# Altium schematic sheet Fri3D_2020_00.SchDoc: Top Level
size A3; Date: 11/07/2018; DrawnBy: Wim Van Gool; DocumentNumber: 1; Revision: 00; SheetNumber: 1; SheetTotal: 5
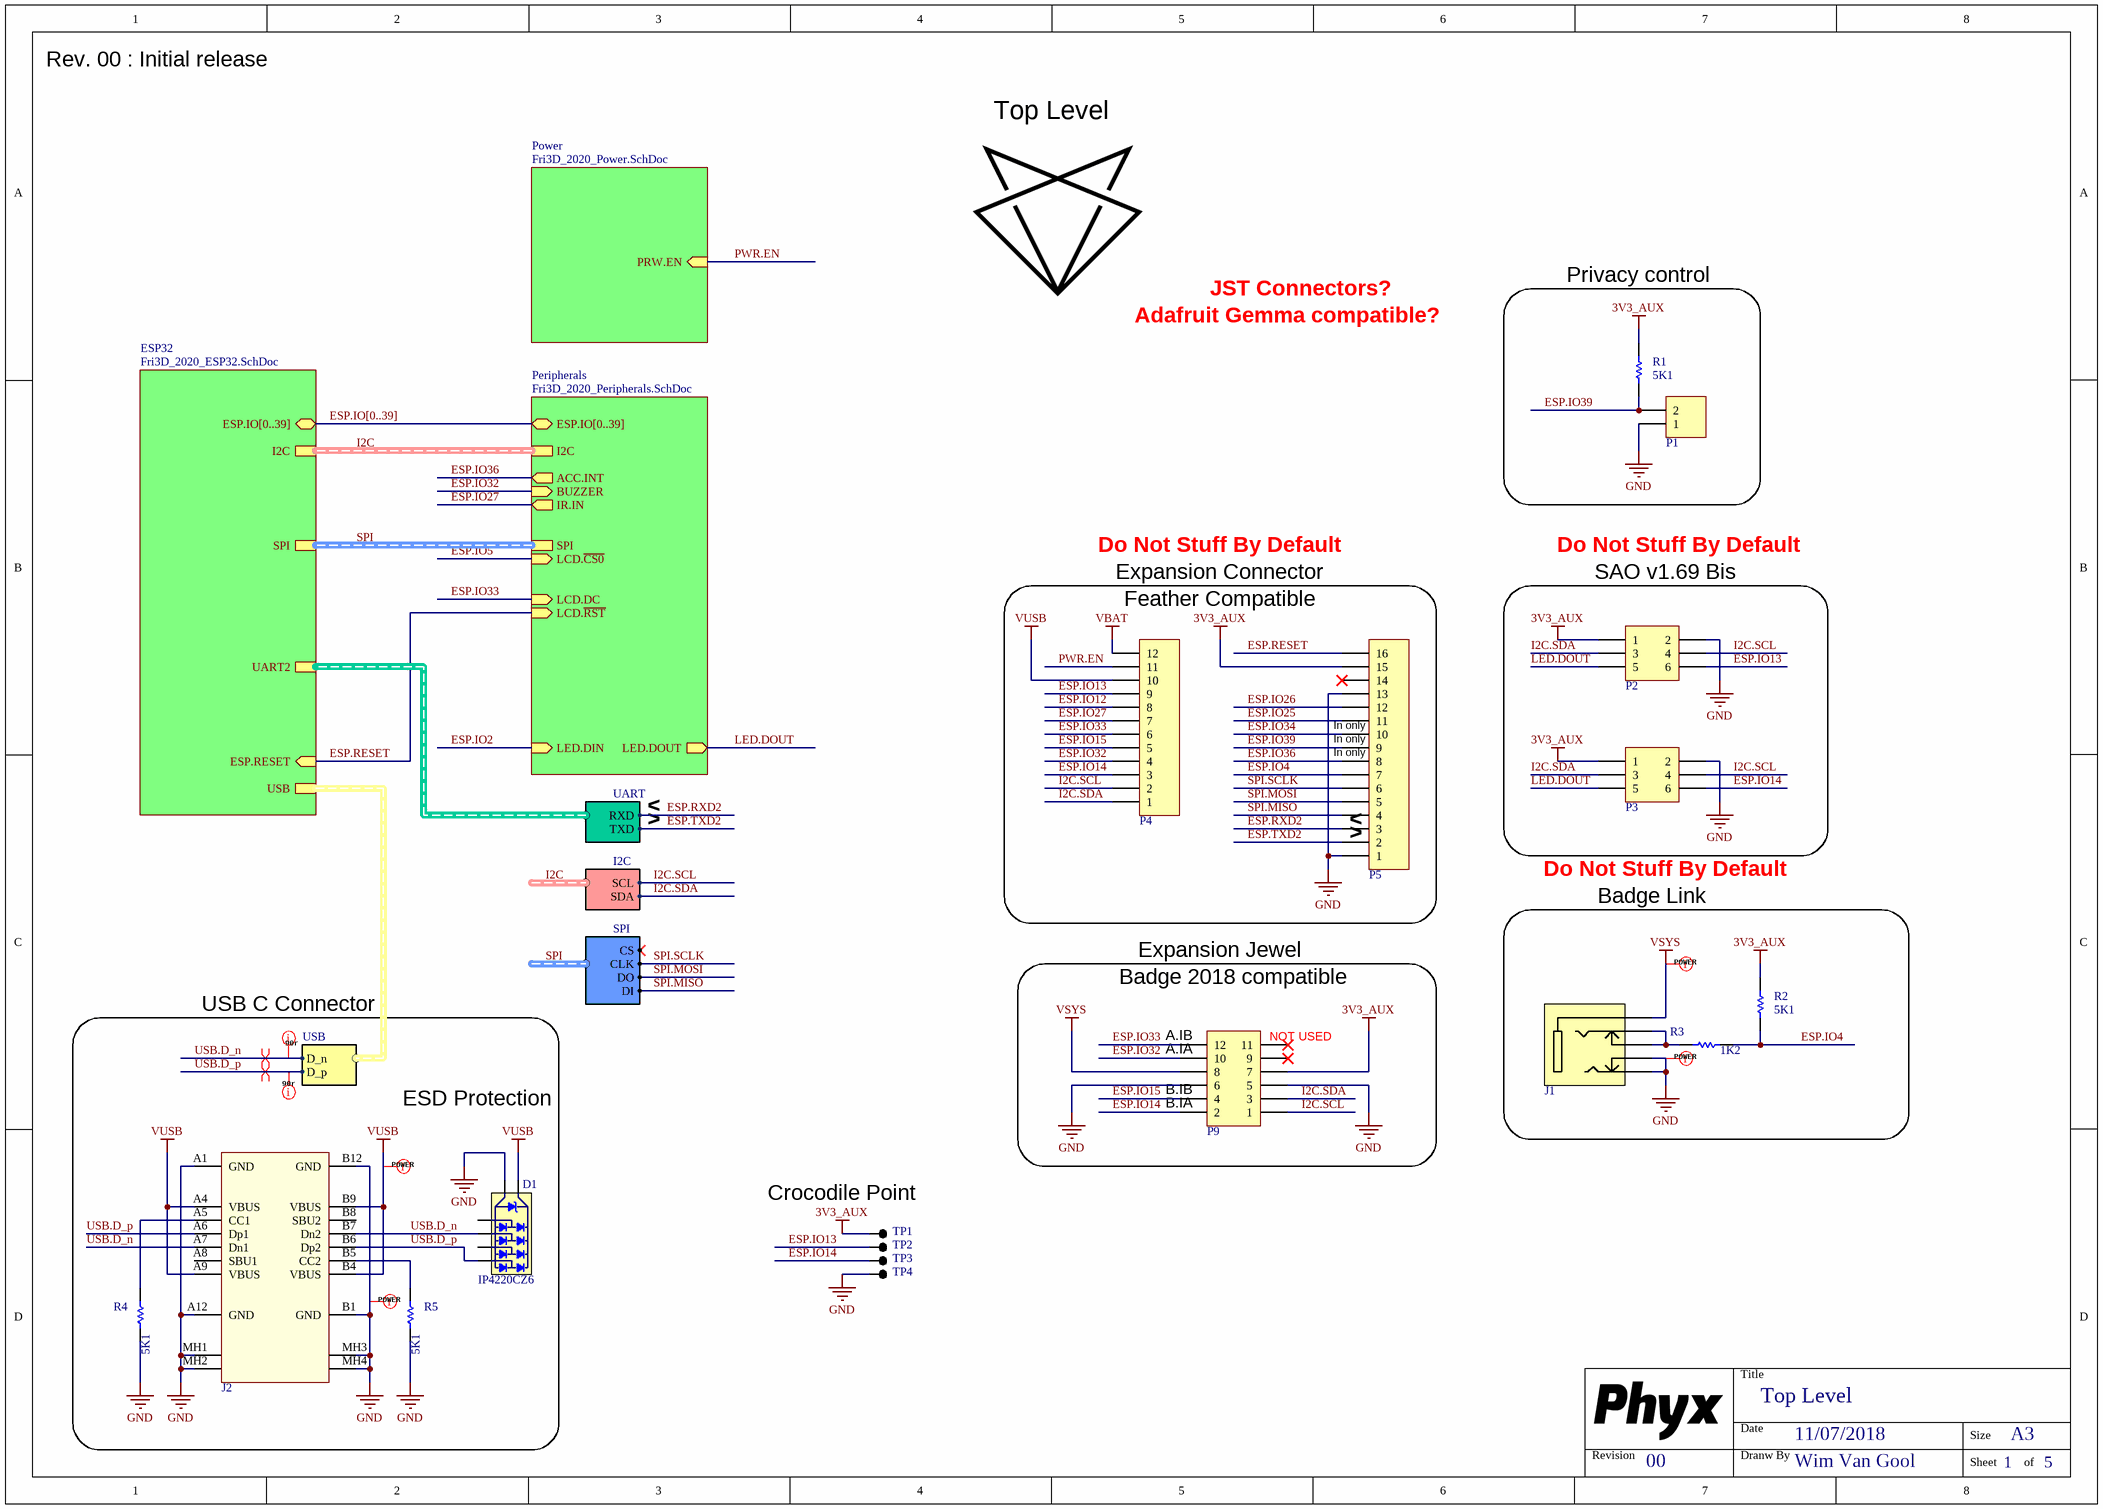
[diagram p0: Fri3D_2020_00.SchDoc]

## Parts
D1  value IP4220CZ6  [NXP_SOT457]  (hidden comment: TVS Diode Dual USB)
J1  3.5mm jack, dual switch, black, 3 contacts  [CUI_SJ1-3525NG]  (value not drawn)
J2  USB 2.0 C Reversible Receptacle Horizontal  [HRO_TYPE-C-31-M-12]  (value not drawn)
P1  Easy to solder connection  [SOLDER_SW_V_1MM]  (value not drawn)
P2  Receptacle 3x2  [RCPT2X3]  (value not drawn)
P3  Receptacle 3x2  [RCPT2X3]  (value not drawn)
P4  Header 12  [HDR1X12]  (value not drawn)
P5  Header 16  [HDR1X16]  (value not drawn)
P9  Receptacle 6x2 SMD low profile  [WE_610312243021_POST]  (value not drawn)
R1  value 5K1  [R0603_N]  (hidden comment: RESISTOR)
R2  value 5K1  [R0603_N]  (hidden comment: RESISTOR)
R3  value 1K2  [R0603_N]  (hidden comment: RESISTOR)
R4  value 5K1  [R0603_N]  (hidden comment: RESISTOR)
R5  value 5K1  [R0603_N]  (hidden comment: RESISTOR)
TP1  TEST_PAD  [TP_0.8mm]  (value not drawn)
TP2  TEST_PAD  [TP_0.8mm]  (value not drawn)
TP3  TEST_PAD  [TP_0.8mm]  (value not drawn)
TP4  TEST_PAD  [TP_0.8mm]  (value not drawn)

## Blocks framed on the sheet
Privacy control: P1 R1
SAO v1.69 Bis: P2 P3
Badge Link: J1 R2 R3

## Sub-sheets
ESP32 = Fri3D_2020_ESP32.SchDoc: I2C (harness I2C), USB (harness USB), SPI (harness SPI), UART2 (harness UART), ESP.RESET (in), ESP.IO[0..39] (bidir)
Peripherals = Fri3D_2020_Peripherals.SchDoc: I2C (harness I2C), ACC.INT (out), BUZZER (in), LED.DIN (in), LED.DOUT (out), SPI (harness SPI), IR.IN (out), LCD.DC (in), LCD.~{RST} (in), LCD.~{CS0} (in), ESP.IO[0..39] (bidir)
Power = Fri3D_2020_Power.SchDoc: PRW.EN (in)

## Harnesses
USB: D_p, D_n
I2C: SDA, SCL
SPI: CS, CLK, DO, DI
UART: TXD, RXD

## Nets
3V3_AUX: P2.1 P3.1 P5.15 P9.7 R1.1 R2.1 TP1.1
GND: D1.2(GND) J1.2(Tip) J1.4 J2.A1(GND) J2.A12(GND) J2.B1(GND) J2.B12(GND) J2.MH1(Tab) J2.MH2(Tab) J2.MH3(Tab) J2.MH4(Tab) P1.1 P2.2 P3.2 P5.1 P5.13 P9.5 P9.6 R4.2 R5.2 TP4.1
VBAT: P4.12
VSYS: J1.1(Sleeve) P9.8
VUSB: D1.5(VBus) J2.A4(VBUS) J2.A9(VBUS) J2.B4(VBUS) J2.B9(VBUS) P4.10
ESP.IO2: sheet Peripherals/LED.DIN
ESP.IO4: P5.7 R2.2 R3.1
ESP.IO5: sheet Peripherals/LCD.~{CS0}
ESP.IO12: P4.8
ESP.IO13: P2.6 P4.9 TP2.1
ESP.IO14: P3.6 P4.3 P9.2 TP3.1
ESP.IO15: P4.5 P9.4
ESP.IO25: P5.11
ESP.IO26: P5.12
ESP.IO27: P4.7 ; sheet Peripherals/IR.IN
ESP.IO32: P4.4 P9.10 ; sheet Peripherals/BUZZER
ESP.IO33: P4.6 P9.12 ; sheet Peripherals/LCD.DC
ESP.IO34: P5.10
ESP.IO36: P5.8 ; sheet Peripherals/ACC.INT
ESP.IO39: P1.2 P5.9 R1.2
ESP.RESET: P5.16 ; sheet Peripherals/LCD.~{RST}, sheet ESP32/ESP.RESET
ESP.RXD2: P5.3 ; sheet ESP32/UART2.RXD
ESP.TXD2: P5.2 ; sheet ESP32/UART2.TXD
I2C.SCL: P2.4 P3.4 P4.2 P9.1 ; sheet Peripherals/I2C.SCL
I2C.SDA: P2.3 P3.3 P4.1 P9.3 ; sheet Peripherals/I2C.SDA
LED.DOUT: P2.5 P3.5 ; sheet Peripherals/LED.DOUT
PWR.EN: P4.11 ; sheet Power/PRW.EN
SPI.MISO: P5.4 ; sheet Peripherals/SPI.DI  [project net SPI.DI]
SPI.MOSI: P5.5 ; sheet Peripherals/SPI.DO  [project net SPI.DO]
SPI.SCLK: P5.6 ; sheet Peripherals/SPI.CLK  [project net SPI.CLK]
USB.D_n: D1.1 J2.A7(Dn1) J2.B7(Dn2) ; sheet ESP32/USB.D_n
USB.D_p: D1.6 J2.A6(Dp1) J2.B6(Dp2) ; sheet ESP32/USB.D_p
NetJ1_3: J1.3(Ring) J1.5 R3.2
NetJ2_A5: J2.A5(CC1) R4.1
NetJ2_B5: J2.B5(CC2) R5.1

Not connected (* = marked no-connect by the designer): D1 3 4; J2 A8(SBU1) B8(SBU2); P5 14*; P9 9* 11*

## Buses and harness runs
bus ESP.IO[0..39] = sheet ESP32/ESP.IO[0..39] = sheet Peripherals/ESP.IO[0..39]
harness I2C = sheet ESP32/I2C = sheet Peripherals/I2C
harness SPI = sheet ESP32/SPI = sheet Peripherals/SPI

## Layout directives
net class 90r: USB.D_n, USB.D_p
differential pair: USB.D_n, USB.D_p
net class POWER: GND, VSYS, VUSB

## Notes on the sheet
- Rev. 00 : Initial release
- JST Connectors?
- Adafruit Gemma compatible?
- Expansion Connector
- Do Not Stuff By Default
- Feather Compatible
- (near P5) In only
- >
- <
- (near P5) >
- (near P5) <
- Expansion Jewel
- Badge 2018 compatible
- USB C Connector
- (near P9) A.IB
- (near P9) A.IA
- (near P9) NOT USED
- ESD Protection
- (near P9) B.IB
- (near P9) B.IA
- Crocodile Point
- Title
- Revision
- Date
- Dranw By
- Size
- A3
- Sheet
- of

## Library data of the parts
D1 = TVS # IP4220CZ6 Dual USB: =Description; Supplier 1: Farnell; Supplier Part Number 1: 2143248
J1 = AUDIO JACK 3.5 3c SJ1-3525NG: =Description; Value: SJ1-3525NG; Supplier 1: Digi-key; Supplier Part Number 1: CP1-3525NG-ND
J2 = USB # C 2.0 RCPT TYPE-C-31-M-12: Value: TYPE-C-31-M-12; Supplier 1: China; Supplier Part Number 1: HRO TYPE-C-31-M-12; Supplier 2: LCSC; Supplier Part Number 2: C165948; Supplier 3: LCSC ALT; Supplier Part Number 3: C167321 / C319148
P1 = SOLDER SW V 1MM: Value: NO BOM
P2 P3 = Receptacle 2.54mm dual row 6way
P4 = Pin Header 2.54mm 12way
P5 = Pin Header 2.54mm 16way
P9 = Receptacle # 2.54mm dual row 12way 610312243021: Value: 610312243021; Supplier 1: Wurth; Supplier Part Number 1: 610312243021
R1 R2 R4 R5 = RES # 5K1 0603: Supplier 1: Farnell; Supplier Part Number 1: 2845922
R3 = RES # 1K2 0603
TP1-TP4 = TP # 0.8mm: Value: NO BOM